# Altium schematic sheet Main.SchDoc
size A4; SheetNumber: 1; SheetTotal: 4
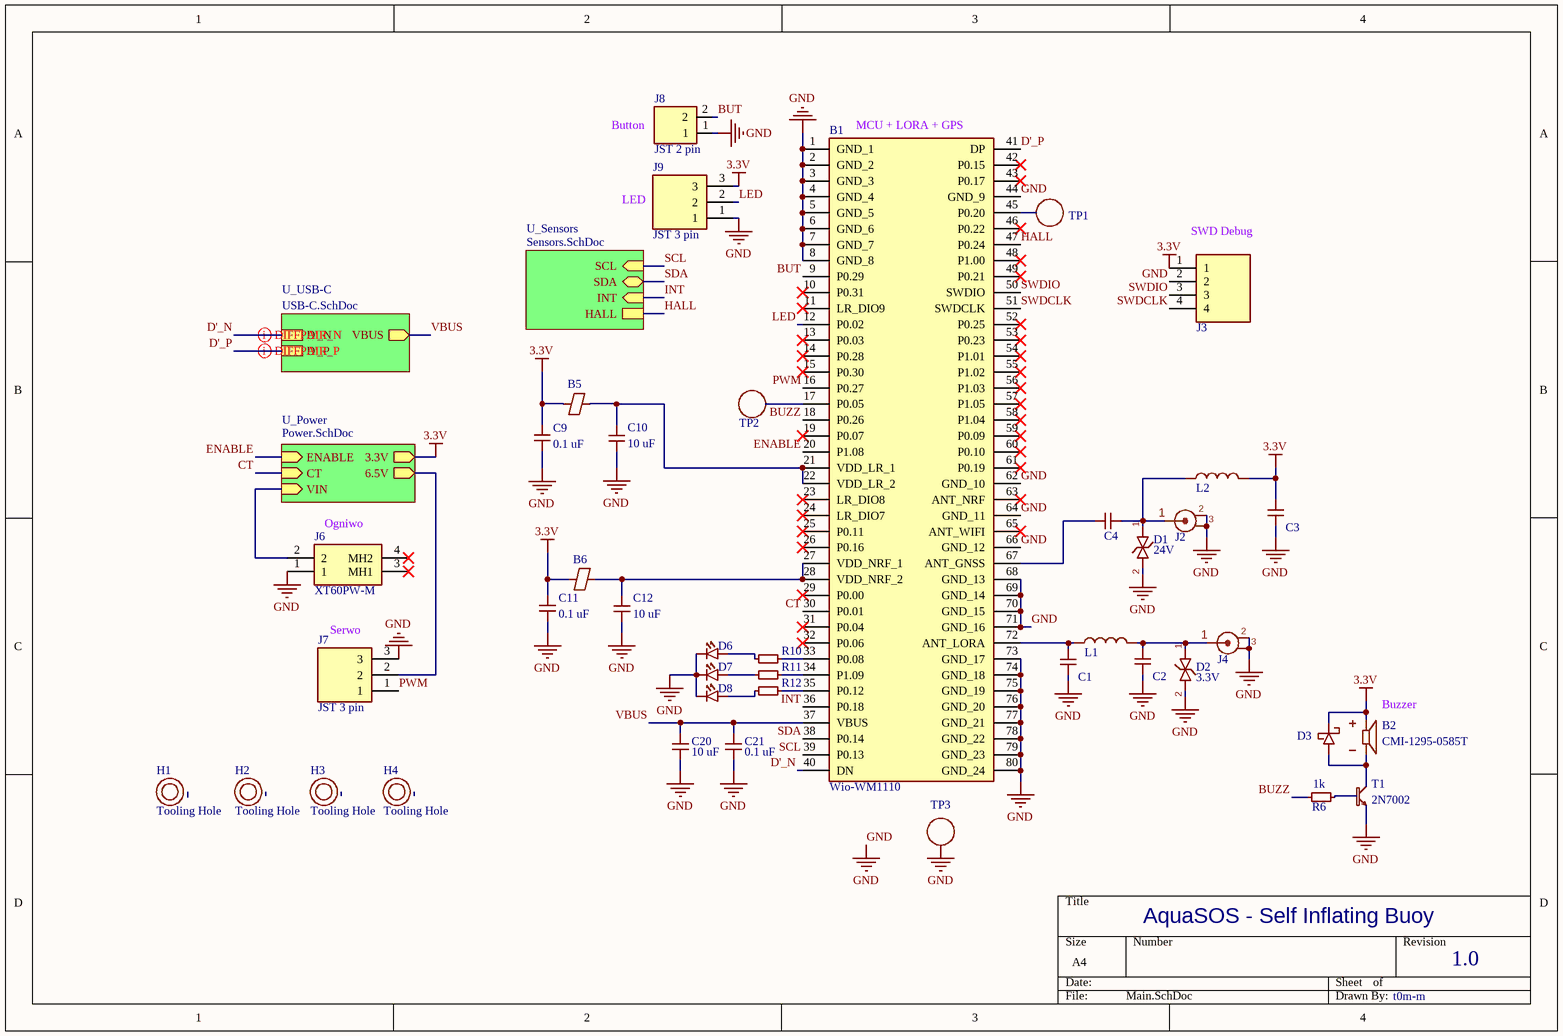
[diagram p0: Main.SchDoc]

## Parts
B1  Wio-WM1110  [WioWM1110]
B2  CMI-1295-0585T  [CMI-1295-0585T]
B5  MPZ1608S121ATDH5  [MPZ1608S121ATDH5]  (value not drawn)
B6  MPZ1608S121ATDH5  [MPZ1608S121ATDH5]  (value not drawn)
C1  Capacitor  [KGM05CS60J106MH]  (value not drawn)
C2  Capacitor  [KGM05CS60J106MH]  (value not drawn)
C3  Capacitor  [KGM05CS60J106MH]  (value not drawn)
C4  Capacitor  [KGM05CS60J106MH]  (value not drawn)
C9  0.1 uF  [MLASU105SB7104KFNB25]
C10  10 uF  [KGM05CS60J106MH]
C11  0.1 uF  [MLASU105SB7104KFNB25]
C12  10 uF  [KGM05CS60J106MH]
C20  10 uF  [KGM05CS60J106MH]
C21  0.1 uF  [MLASU105SB7104KFNB25]
D1  24V  [RCLAMP2431TTCT]
D2  CPDV3V3A-HF  [CPDV3V3A-HF]  (value not drawn)
D3  BAT5402VH6327XTSA1  [BAT5402VH6327XTSA1]  (value not drawn)
D6  APT1608SGC  [APT1608SGC]  (value not drawn)
D7  APT1608SGC  [APT1608SGC]  (value not drawn)
D8  APT1608SGC  [APT1608SGC]  (value not drawn)
H1  Tooling Hole  [Tooling Hole]  (no BOM)
H2  Tooling Hole  [Tooling Hole]  (no BOM)
H3  Tooling Hole  [Tooling Hole]  (no BOM)
H4  Tooling Hole  [Tooling Hole]  (no BOM)
J2  U.FL-R-SMT-1(10)  [HRS_U.FL-R-SMT-1(10)]  (value not drawn)
J3  22-10-2041  [1x4 Goldpin Header]  (value not drawn)
J4  U.FL-R-SMT-1(10)  [HRS_U.FL-R-SMT-1(10)]  (value not drawn)
J6  XT60PW-M  [XT60PWM]
J7  JST 3 pin  [S3B-PH-K-S]
J8  JST 2 pin  [JST_S2B-PH-K-S(LF)(SN)]
J9  JST 3 pin  [S3B-PH-K-S]
L1  Inductor  [KGM05CS60J106MH]  (value not drawn)
L2  Inductor  [KGM05CS60J106MH]  (value not drawn)
R6  MR04X102 JTL  [MR04X102 JTL]  (value not drawn)
R10  300  [RC0402JR-075K1P]  (value not drawn)
R11  300  [RC0402JR-075K1P]  (value not drawn)
R12  300  [RC0402JR-075K1P]  (value not drawn)
T1  2N7002  [2N7002]
TP1  TP  [Test Point]  (value not drawn)  (no BOM)
TP2  TP  [Test Point]  (value not drawn)  (no BOM)
TP3  TP  [Test Point]  (value not drawn)  (no BOM)

## Sub-sheets
U_Power = Power.SchDoc: ENABLE (in), 6.5V (out), VIN (in), CT (in), 3.3V (out)
U_Sensors = Sensors.SchDoc: SCL (in), SDA (bidir), INT (in), HALL
U_USB-C = USB-C.SchDoc: VBUS (out), D'_N, D'_P

## Nets
3.3V: B2.P B5.1 B6.1 C3.1 C9.1 C11.1 D3.2(A) J3.1 J9.3 L2.2 ; sheet U_Power/3.3V
GND: B1.1(GND_1) B1.2(GND_2) B1.3(GND_3) B1.4(GND_4) B1.5(GND_5) B1.6(GND_6) B1.7(GND_7) B1.8(GND_8) B1.44(GND_9) B1.62(GND_10) B1.64(GND_11) B1.66(GND_12) B1.68(GND_13) B1.69(GND_14) B1.70(GND_15) B1.71(GND_16) B1.73(GND_17) B1.74(GND_18) B1.75(GND_19) B1.76(GND_20) B1.77(GND_21) B1.78(GND_22) B1.79(GND_23) B1.80(GND_24) C1.2 C2.2 C3.2 C9.2 C10.2 C11.2 C12.2 C20.2 C21.2 D1.2(A) D2.2(A) D6.1(K) D7.1(K) D8.1(K) J2.2 J2.3 J3.2 J4.2 J4.3 J6.1 J7.3 J8.1 J9.1 T1.2(S) TP3.1
BUT: B1.9(P0.29) J8.2
BUZZ: B1.18(P0.26) R6.1
CT: B1.30(P0.01) ; sheet U_Power/CT
D'_N: B1.40(DN) ; sheet U_USB-C/D'_N
D'_P: B1.41(DP) ; sheet U_USB-C/D'_P
ENABLE: B1.20(P1.08) ; sheet U_Power/ENABLE
HALL: B1.47(P0.24) ; sheet U_Sensors/HALL
INT: B1.36(P0.18) ; sheet U_Sensors/INT
LED: B1.12(P0.02) J9.2
PWM: B1.16(P0.27) J7.1
SCL: B1.39(P0.13) ; sheet U_Sensors/SCL
SDA: B1.38(P0.14) ; sheet U_Sensors/SDA
SWDCLK: B1.51(SWDCLK) J3.4
SWDIO: B1.50(SWDIO) J3.3
VBUS: B1.37(VBUS) C20.1 C21.1 ; sheet U_USB-C/VBUS
NetB1_17: B1.17(P0.05) TP2.1
NetB1_21: B1.21(VDD_LR_1) B1.22(VDD_LR_2) B5.2 C10.1
NetB1_27: B1.27(VDD_NRF_1) B1.28(VDD_NRF_2) B6.2 C12.1
NetB1_33: B1.33(P0.08) R10.2
NetB1_34: B1.34(P1.09) R11.2
NetB1_35: B1.35(P0.12) R12.2
NetB1_45: B1.45(P0.20) TP1.1
NetB1_67: B1.67(ANT_GNSS) C4.1
NetB1_72: B1.72(ANT_LORA) C1.1 L1.1
NetB2_N: B2.N D3.1(K) T1.3(D)
NetC2_1: C2.1 D2.1(K) J4.1 L1.2
NetC4_2: C4.2 D1.1(K) J2.1 L2.1
NetD6_2: D6.2(A) R10.1
NetD7_2: D7.2(A) R11.1
NetD8_2: D8.2(A) R12.1
NetJ6_2: J6.2 ; sheet U_Power/VIN
NetJ7_2: J7.2 ; sheet U_Power/6.5V
NetR6_2: R6.2 T1.1(G)

Not connected (* = marked no-connect by the designer): B1 10(P0.31)* 11(LR_DIO9)* 13(P0.03)* 14(P0.28)* 15(P0.30)* 19(P0.07)* 23(LR_DIO8)* 24(LR_DIO7)* 25(P0.11)* 26(P0.16)* 29(P0.00)* 31(P0.04)* 32(P0.06)* 42(P0.15)* 43(P0.17)* 46(P0.22)* 48(P1.00)* 49(P0.21)* 52(P0.25)* 53(P0.23)* 54(P1.01)* 55(P1.02)* 56(P1.03)* 57(P1.05)* 58(P1.04)* 59(P0.09)* 60(P0.10)* 61(P0.19)* 63(ANT_NRF)* 65(ANT_WIFI)*; J6 3(MH1)* 4(MH2)*

## Layout directives
differential pair: D'_N, D'_P

## Notes on the sheet
- (near J8) Button
- (near B1) MCU + LORA + GPS
- LED
- (near J3) SWD Debug
- (near J6) Ogniwo
- (near J7) Serwo
- (near D2) 3.3V
- (near B2) Buzzer
- (near R6) 1k
- AquaSOS - Self Inflating Buoy
- 1.0
- t0m-m

## Library data of the parts
B1 = Wio-WM1110: LoRa Wireless Module - Powered by Semtech; Manufacturer_Name: Seeed Studio; Geometry.Height: 2.3mm; Manufacturer_Part_Number: Wio-WM1110; Mouser Part Number: *; Mouser Price/Stock: *; Arrow Part Number: *; Arrow Price/Stock: *; Datasheet Link: https://files.seeedstudio.com/products/SenseCAP/Wio-WM1110/Wio-WM1110_Module_Datasheet_V1.3.pdf; ComponentLink1Description: Shop link; ComponentLink1URL: https://botland.com.pl/lokalizatory-gps-gsm-bluetooth/23517-wio-wm1110-uklad-loragpswifibluetooth-semtech-lr1110-nordic-nrf52840-seeedstudio-114992865.html
B2 = CMI-1295-0585T: Buzzer
B5 B6 = MPZ1608S121ATDH5: Ferrite Beads 0603 120ohms 2000mA Power Line AEC-Q200; Manufacturer_Name: TDK; Geometry.Height: 0.75mm; Mouser Part Number: 810-MPZ1608S121ATDH5; Mouser Price/Stock: https://www.mouser.co.uk/ProductDetail/TDK/MPZ1608S121ATDH5?qs=pvNC7ksEVIcGR4VJPzSI2g%3D%3D; Manufacturer_Part_Number: MPZ1608S121ATDH5; Datasheet Link: https://product.tdk.com/system/files/dam/doc/product/emc/emc/beads/catalog/beads_automotive_power_mpz1608_en.pdf
C1-C4 = Capacitor: 0402 SMD
C9 C11 C21 = MLASU105SB7104KFNB25: 0.1uF Capacitor
C10 C12 C20 = KGM05CS60J106MH: 10 uF Capacitor
D1 = RCLAMP2431T.TCT: ESD Suppressors / TVS Diodes LOW CAP/ESD CLAP, 1 LINE; Manufacturer_Name: SEMTECH; Geometry.Height: 0.43mm; Mouser Part Number: 947-RCLAMP2431T.TCT; Mouser Price/Stock: https://www.mouser.co.uk/ProductDetail/Semtech/RCLAMP2431T.TCT?qs=rBWM4%252BvDhIfEdbY6IS5fCw%3D%3D; Manufacturer_Part_Number: RCLAMP2431T.TCT; Datasheet Link: https://semtech.my.salesforce.com/sfc/p/#E0000000JelG/a/44000000MChm/nAD_16Ash9zTcNc8tEIG0CGjjA0gXByRbqZlpqVEQMY
D2 = CPDV3V3A-HF: 3.3 V, 0.4pF, Bidirectional
D3 = BAT5402VH6327XTSA1: Schottky Diode
D6-D8 = APT1608SGC: 0402 SMD LED
J2 J4 = U.FL-R-SMT-1(10): Antenna Connector
J3 = 1x4 Goldpin Header: Headers & Wire Housings VERT PCB HDR 4P GOLD PLATING; Manufacturer_Name: Molex; Geometry.Height: 11.17mm; Mouser Part Number: 538-22-10-2041; Mouser Price/Stock: https://www.mouser.co.uk/ProductDetail/Molex/22-10-2041?qs=I2tGkhXPHwPlInpHG6ZNmQ%3D%3D; Manufacturer_Part_Number: 22-10-2041; Datasheet Link: https://www.molex.com/en-us/products/part-detail/22102041?display=pdf
J6 = XT60PW-M: Connector: DC supply; socket; XT60; male; PIN: 2; on PCBs; THT; 30A; Manufacturer_Name: Amass; Geometry.Height: 8.4mm; TME Electronic Components Part Number: *; TME Electronic Components Price/Stock: *; Manufacturer_Part_Number: XT60PW-M; Datasheet Link: https://www.tme.eu/Document/b13629717d44ae038681dba08d18c0b6/XT60PW-M.pdf
J7 J9 = JST 3 pin: JST 3 pin connector
J8 = JST 2 pin: Connector Header Through Hole, Right Angle 2 position; MF: JST Sales America Inc.; MP: S2B-PH-K-S(LF)(SN); SnapEDA_Link: https://www.snapeda.com/parts/S2B-PH-K-S(LF)(SN)/JST/view-part/?ref=snap; Package: NON STANDARD-2 J.S.T.; Value: *; Check_prices: https://www.snapeda.com/parts/S2B-PH-K-S(LF)(SN)/JST/view-part/?ref=eda
R6 = MR04X102 JTL: 1k 0402 Resistor
R10-R12 = CR0402-FX-3000GLF
T1 = 2N7002: Transistor
TP1-TP3 = Test Point